# Altium schematic sheet CONNECTORS.SchDoc
size A; SheetNumber: 2; SheetTotal: 2
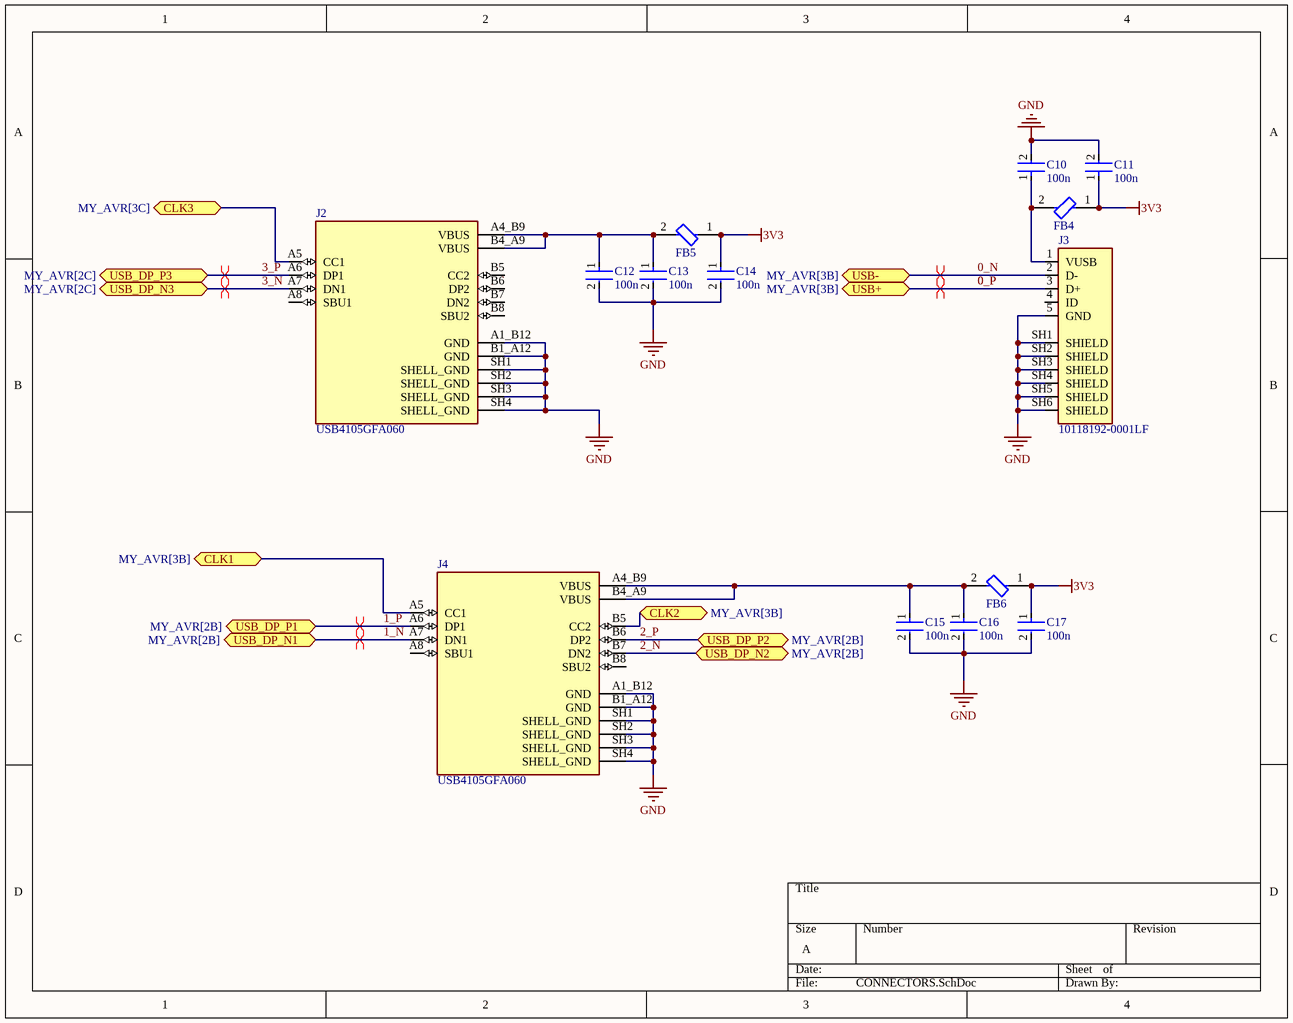
[diagram p0: CONNECTORS.SchDoc]

## Parts
C10  100n  [FP-CL10-IPC_C]
C11  100n  [FP-CL10-IPC_C]
C12  100n  [FP-CL10-IPC_C]
C13  100n  [FP-CL10-IPC_C]
C14  100n  [FP-CL10-IPC_C]
C15  100n  [FP-CL10-IPC_C]
C16  100n  [FP-CL10-IPC_C]
C17  100n  [FP-CL10-IPC_C]
FB4  BLM18KG121TN1D  [FP-BLM18-0_15-t0_6-d1_2-IPC_A]  (value not drawn)
FB5  BLM18KG121TN1D  [FP-BLM18-0_15-t0_6-d1_2-IPC_A]  (value not drawn)
FB6  BLM18KG121TN1D  [FP-BLM18-0_15-t0_6-d1_2-IPC_A]  (value not drawn)
J2  USB4105GFA060  [GCT_USB4105GFA060]
J3  10118192-0001LF  [AMPHENOL_10118192-0001LF]
J4  USB4105GFA060  [GCT_USB4105GFA060]

## Ports
CLK1 (bidir, see MY_AVR[3B]), CLK2 (bidir, see MY_AVR[3B]), CLK3 (bidir, see MY_AVR[3C]), USB+ (bidir, see MY_AVR[3B]), USB- (bidir, see MY_AVR[3B]), USB_DP_N1 (bidir, see MY_AVR[2B]), USB_DP_N2 (bidir, see MY_AVR[2B]), USB_DP_N3 (bidir, see MY_AVR[2C]), USB_DP_P1 (bidir, see MY_AVR[2B]), USB_DP_P2 (bidir, see MY_AVR[2B]), USB_DP_P3 (bidir, see MY_AVR[2C])

## Nets
3V3: C11.1 C14.1 C17.1 FB4.1 FB5.1 FB6.1
GND: C10.2 C11.2 C12.2 C13.2 C14.2 C15.2 C16.2 C17.2 J2.A1_B12(GND) J2.B1_A12(GND) J2.SH1(SHELL_GND) J2.SH2(SHELL_GND) J2.SH3(SHELL_GND) J2.SH4(SHELL_GND) J3.5(GND) J3.SH1(SHIELD) J3.SH2(SHIELD) J3.SH3(SHIELD) J3.SH4(SHIELD) J3.SH5(SHIELD) J3.SH6(SHIELD) J4.A1_B12(GND) J4.B1_A12(GND) J4.SH1(SHELL_GND) J4.SH2(SHELL_GND) J4.SH3(SHELL_GND) J4.SH4(SHELL_GND)
0_N: J3.2(D-) ; port USB-
0_P: J3.3(D+) ; port USB+
1_N: J4.A7(DN1) ; port USB_DP_N1
1_P: J4.A6(DP1) ; port USB_DP_P1
2_N: J4.B7(DN2) ; port USB_DP_N2
2_P: J4.B6(DP2) ; port USB_DP_P2
3_N: J2.A7(DN1) ; port USB_DP_N3
3_P: J2.A6(DP1) ; port USB_DP_P3
CLK1: J4.A5(CC1) ; port CLK1
CLK2: J4.B5(CC2) ; port CLK2
CLK3: J2.A5(CC1) ; port CLK3
NetC10_1: C10.1 FB4.2 J3.1(VUSB)
NetC12_1: C12.1 C13.1 FB5.2 J2.A4_B9(VBUS) J2.B4_A9(VBUS)
NetC15_1: C15.1 C16.1 FB6.2 J4.A4_B9(VBUS) J4.B4_A9(VBUS)

Not connected (* = marked no-connect by the designer): J2 A8(SBU1) B5(CC2) B6(DP2) B7(DN2) B8(SBU2); J3 4(ID); J4 A8(SBU1) B8(SBU2)

## Layout directives
differential pair: 0_N, 0_P, 1_N, 1_P, 3_P
differential pair; net class diff3: 3_N

## Library data of the parts
C10-C17 = CMP-13271-003017-1: Cap Ceramic 4.7uF 10V X5R ±10% Pad SMD 0603 +85°C T/R; Capacitance: 4.7uF; Case/Package: 0603; Packaging: Tape and Reel; Width: 0.031inch; Contact Plating: Tin; Thickness: 0.035inch; Package Quantity: 1; Voltage Rating: 10V; Case Code (Metric): 1608; Case Code (Imperial): 0603; Depth: 0.8mm; Height: 0.8mm; Tolerance: 10%; Max Operating Temperature: 85°C; Length: 1.6mm; Dielectric: X5R; Mount: Surface Mount; Radiation Hardening: No; Min Operating Temperature: -55°C
FB4-FB6 = CMP-0686-00554-8: FERRITE BEAD 120 OHM 0603 1LN; Max Current Rating: 3A; DC Resistance (DCR): 30mR; Impedance: 120R; Number of Lines: 1; Test Frequency: 100MHz; Tolerance: 25%; Package Quantity: 4000; Min Operating Temperature: -55°C; Termination: SMD/SMT; REACH SVHC: No SVHC; Core Material: Ferrite; Material: Ferrite; Current Rating: 3A; Height: 0.8mm; Number of Pins: 2; Case/Package: 0603; Case Code (Imperial): 0603; Series: BLM18K; Packaging: Tape and Reel; Inductor Type: FERRITE BEAD; Lead Free: Lead Free; Width: 0.8mm; Case Code (Metric): 1608; Number of Circuits: 1; Max DC Current: 3A; Depth: 0.95mm; Max Operating Temperature: 125°C; Length: 1.6mm; RoHS Compliant: Yes
J2 J4 = USB4105GFA060: MF: {'manufacturer': u'GCT'}; Package: None; Price: None; Value: *; MP: USB4105GFA060; Availability: Unavailable
J3 = 10118192-0001LF: Micro USB, Input Output Connectors, B TYPE RECEPTACLE with flange; MF: Amphenol ICC; Check_prices: https://www.snapeda.com/parts/10118192-0001LF/Amphenol+FCI/view-part/?ref=eda; Value: *; Availability: In Stock; MP: 10118192-0001LF; Price: None; Package: None; Purchase-URL: https://pricing.snapeda.com/search/part/10118192-0001LF/?ref=eda; SnapEDA_Link: https://www.snapeda.com/parts/10118192-0001LF/Amphenol+FCI/view-part/?ref=snap